# Altium schematic sheet 06.SchDoc
size 297 x 209 mm
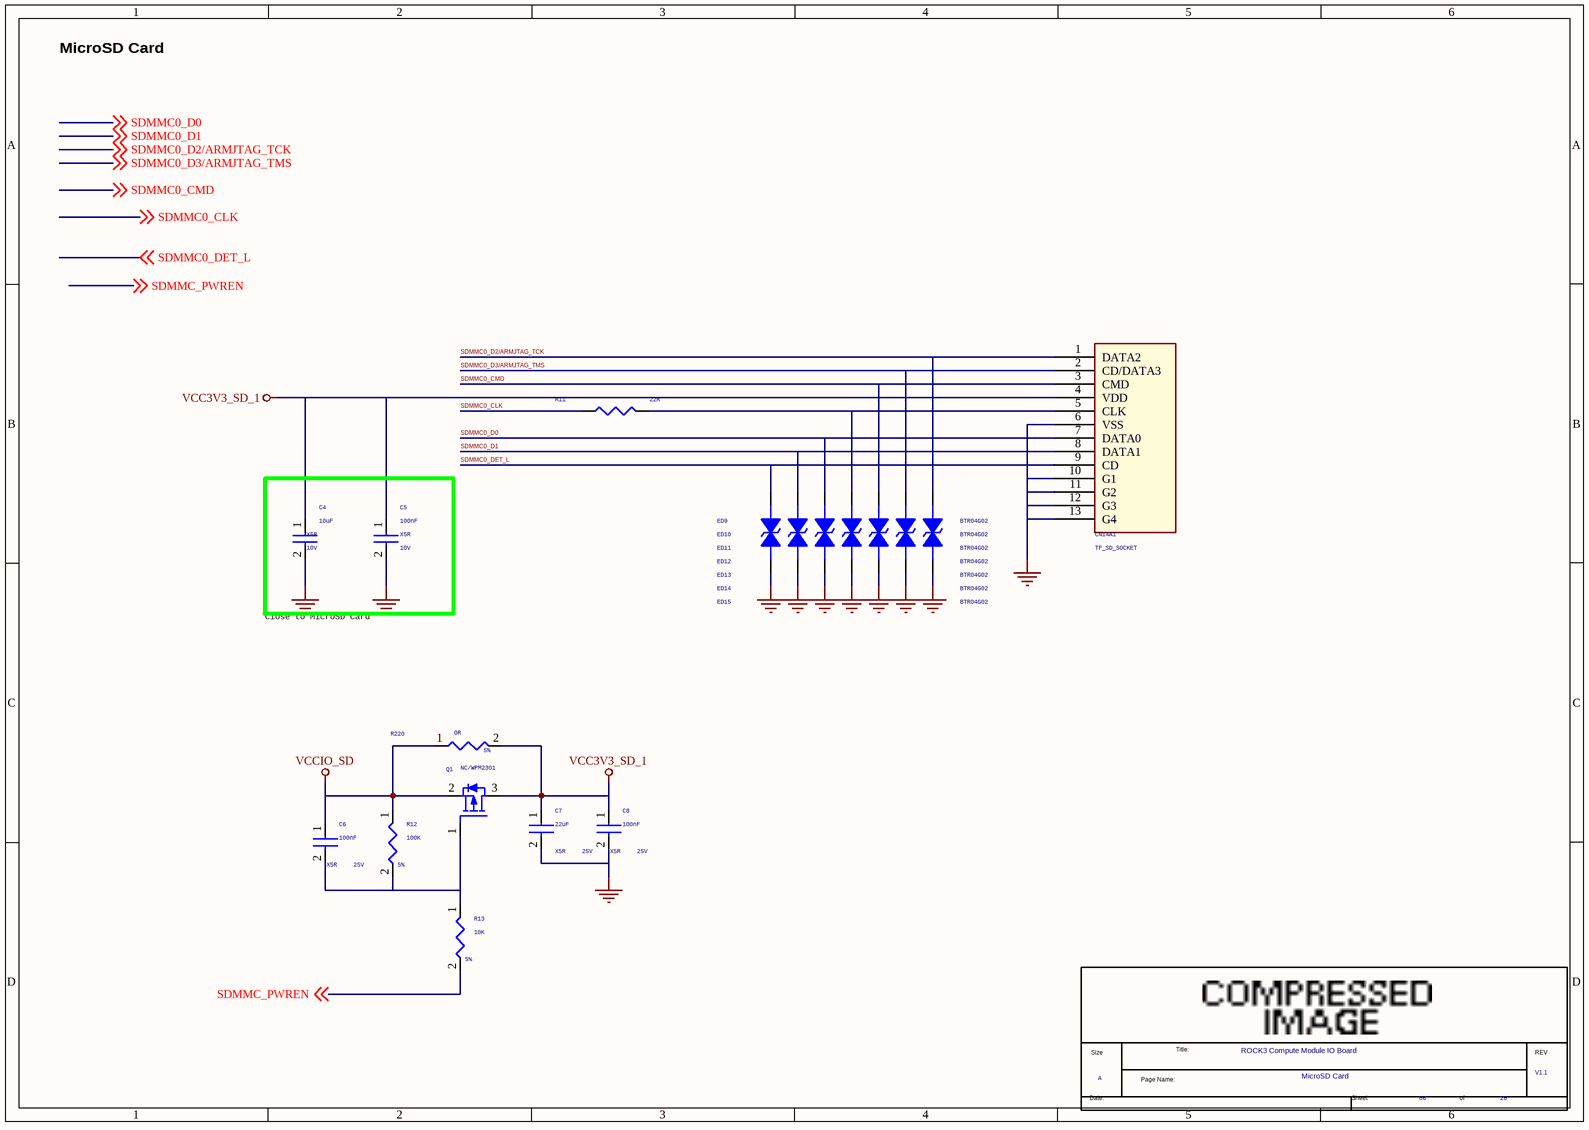
[diagram p0: 06.SchDoc]

## Parts
*  Page Count: 20  Page Number: 06  Page Size: A  Title: ROCK3 Compute Module IO Board  RevCode: V1.1  Doc: MicroSD Card  (hidden comment: radxa_gong)  (graphical)
C4  10uF  Voltage: 10V  Dielectric: X5R  [C0603]
C5  100nF  Voltage: 10V  Dielectric: X5R  [C0402]
C6  100nF  Voltage: 25V  Dielectric: X5R  [C0402]
C7  22uF  Voltage: 25V  Dielectric: X5R  [C0805]
C8  100nF  Voltage: 25V  Dielectric: X5R  [C0402]
CN14A1  TF_SD_SOCKET  [TF-CKT01-009D]
ED9  BTR04G02  [E0402N]
ED10  BTR04G02  [E0402N]
ED11  BTR04G02  [E0402N]
ED12  BTR04G02  [E0402N]
ED13  BTR04G02  [E0402N]
ED14  BTR04G02  [E0402N]
ED15  BTR04G02  [E0402N]
Q1  NC/WPM2301  [SOT23]
R11  22R  [R0402]
R12  100K  Tolerance: 5%  [R0402]
R13  10K  Tolerance: 5%  [R0402]
R220  0R  Tolerance: 5%  [R0402]

## Nets
GND: C4.2 C5.2 C7.2 C8.2 CN14A1.6(VSS) CN14A1.10(G1) CN14A1.11(G2) CN14A1.12(G3) CN14A1.13(G4) ED9.2 ED10.2 ED11.2 ED12.2 ED13.2 ED14.2 ED15.2
VCC3V3_SD_1: C4.1 C5.1 C7.1 C8.1 CN14A1.4(VDD) Q1.3(DRAIN) R220.2
VCCIO_SD: C6.1 Q1.2(SOURCE) R12.1 R220.1
SDMMC0_CLK: R11.1 ; off-sheet SDMMC0_CLK
SDMMC0_CMD: CN14A1.3(CMD) ED13.1 ; off-sheet SDMMC0_CMD
SDMMC0_D0: CN14A1.7(DATA0) ED11.1 ; off-sheet SDMMC0_D0
SDMMC0_D1: CN14A1.8(DATA1) ED10.1 ; off-sheet SDMMC0_D1
SDMMC0_D2/ARMJTAG_TCK: CN14A1.1(DATA2) ED15.1 ; off-sheet SDMMC0_D2/ARMJTAG_TCK
SDMMC0_D3/ARMJTAG_TMS: CN14A1.2(CD/DATA3) ED14.1 ; off-sheet SDMMC0_D3/ARMJTAG_TMS
SDMMC0_DET_L: CN14A1.9(CD) ED9.1 ; off-sheet SDMMC0_DET_L
SDMMC_PWREN: R13.2 ; off-sheet SDMMC_PWREN
NetC6_2: C6.2 Q1.1(GATE) R12.2 R13.1
NetCN14A1_5: CN14A1.5(CLK) ED12.1 R11.2

## Notes on the sheet
- MicroSD Card
- Close to MicroSD Card
- (in symbol radxa_gong) Title:; Size; REV; Page Name:; Date:; Sheet; of

## Library data of the parts
C4 = CAP NP_Dup2: cap,10.00uF,+/-10%,10V,X5R,C0603; Manufacturer PN: C1608X5R1A106K080AC; Manufacturer: TDK; Tolerance: 10%; C_Voltage: 6.3V; Priority: A; Created by: JJJ; Part Type: C0603; RK PN: C1608X5R1A106K080AC
C5 = CAP NP_Dup2: cap,100.00nF,+/-10%,10V,X5R,C0402; Manufacturer PN: C1005X5R1A104K050BA; Manufacturer: TDK; C_Voltage: 6.3V; Tolerance: 10%; Priority: A; Created by: JJJ; Part Type: C0402; RK PN: C1005X5R1A104K050BA
C6 = CAP NP_Dup2: cap,100.00nF,+/-10%,16V,X5R,C0402; Manufacturer PN: C1005X5R1C104K050BA; Manufacturer: TDK; Tolerance: 10%; Priority: A; Created by: JJJ; Part Type: C0402; RK PN: C1005X5R1C104K050BA
C7 = CAP NP_Dup2: cap,10.00uF,+/-10%,6.3V,X5R,C0603; Manufacturer: TDK; RK PN: C1608X5R0J106K080AB; Priority: A; Tolerance: 10%; Part Type: C0603; Manufacturer PN: C1608X5R0J106K080AB; Created by: JJJ
C8 = CAP NP_Dup2: cap,100.00nF,+/-10%,16V,X5R,C0402; Manufacturer: TDK; RK PN: C1005X5R1C104K050BA; Priority: A; Tolerance: 10%; Part Type: C0402; Manufacturer PN: C1005X5R1C104K050BA; Created by: JJJ
CN14A1 = SD_SOCKET_0
ED9-ED15 = DIODE BI-DIR TRIG: ESD
Q1 = MOSFET P_Dup1: PMOS,WPM3407-3/TR,SOT_23,Id=4.4A,Vds=30V; Manufacturer: WillSemi(韦尔半导体); Priority: A; Id_max: 4.4A; Vgs: ±20V; VDS: 30V; Vgsth: 2.0V; Pd: 0.9W; RK PN: WPM3407-3/TR; Part Type: PMOS; Manufacturer PN: WPM3407-3/TR; Created by: JJJ
R11 = RESISTOR_1
R12 = RESISTOR_Dup1: 通用厚膜电阻,100K,+/-5%,R0402,1/16W.; Manufacturer: YAGEO; RK PN: RC0402JR-07100KL; Priority: A; Wattage: 1/16W; Part Type: 通用厚膜电阻; Manufacturer PN: RC0402JR-07100KL; Created by: YTL
R13 = RESISTOR_Dup1: 通用厚膜电阻,10K,+/-5%,R0402,1/16W.; Manufacturer PN: RC0402JR-0710KL; Manufacturer: YAGEO; Wattage: 1/16W; Priority: A; Created by: YTL; Part Type: 通用厚膜电阻; RK PN: RC0402JR-0710KL
R220 = RESISTOR_Dup1: 通用厚膜电阻,0R,+/-5%,R0402,1/16W.; Manufacturer: YAGEO; RK PN: RC0402JR-070RL; Priority: A; Wattage: 1/16W; Part Type: 通用厚膜电阻; Manufacturer PN: RC0402JR-070RL; Created by: YTL
* = radxa_gong: Page Create Date: March  8, 1995